# EasyEDA Pro project 无线充电接收端.epro, schematic 无线充电接收V2.0
Board Name: 无线充电接收V2.0; Create Date: 2025-05-22; Page Name: P1; Project Name: （5月更新）无线充电接收端; Schematic Name: 无线充电接收V2.0; Update Date: 2025-05-22; Company: 嘉立创EDA; Page Size: A4; Version: V1.0
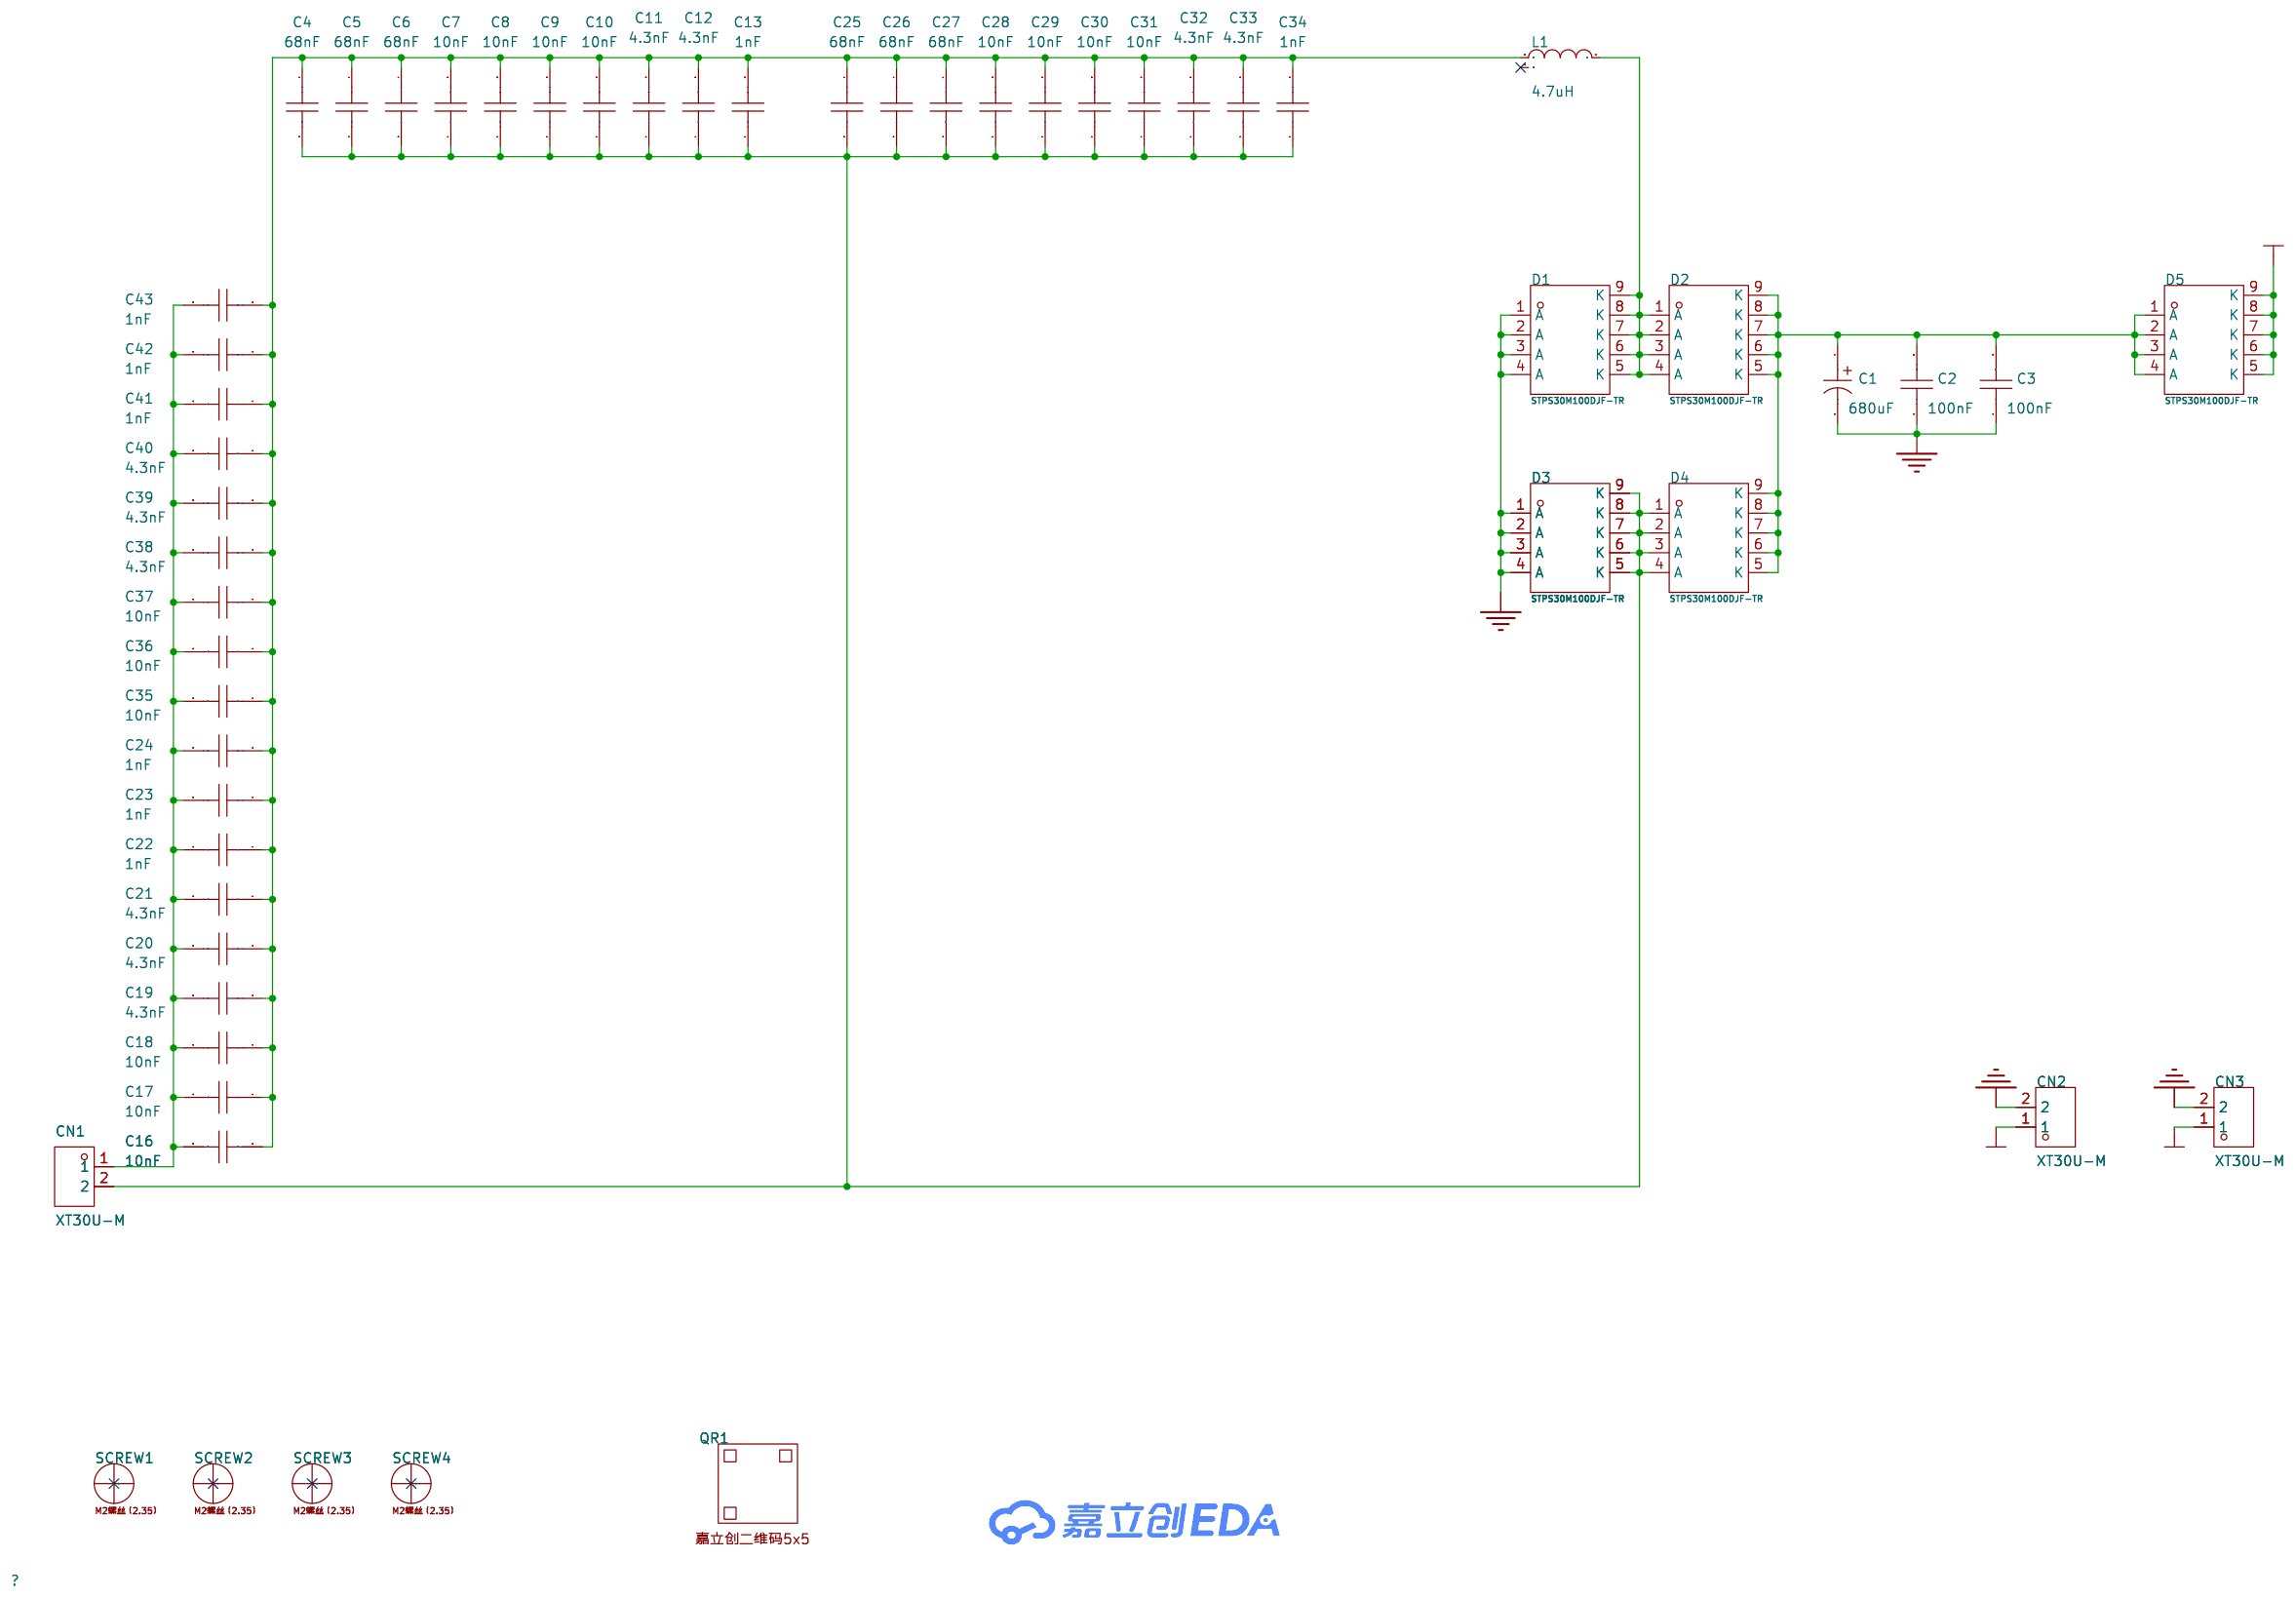
[diagram p2: schematic sheet]

## Parts
C1  680uF  [CAP-TH_BD8.0-P3.50-D0.6-FD]
C2  100nF  [C1206]
C3  100nF  [C1206]
C4  68nF  [C1206]
C5  68nF  [C1206]
C6  68nF  [C1206]
C7  10nF  [C1206]
C8  10nF  [C1206]
C9  10nF  [C1206]
C10  10nF  [C1206]
C11  4.3nF  [C1206]
C12  4.3nF  [C1206]
C13  1nF  [C1206]
C16  10nF  [C1206]
C17  10nF  [C1206]
C18  10nF  [C1206]
C19  4.3nF  [C1206]
C20  4.3nF  [C1206]
C21  4.3nF  [C1206]
C22  1nF  [C1206]
C23  1nF  [C1206]
C24  1nF  [C1206]
C25  68nF  [C1206]
C26  68nF  [C1206]
C27  68nF  [C1206]
C28  10nF  [C1206]
C29  10nF  [C1206]
C30  10nF  [C1206]
C31  10nF  [C1206]
C32  4.3nF  [C1206]
C33  4.3nF  [C1206]
C34  1nF  [C1206]
C35  10nF  [C1206]
C36  10nF  [C1206]
C37  10nF  [C1206]
C38  4.3nF  [C1206]
C39  4.3nF  [C1206]
C40  4.3nF  [C1206]
C41  1nF  [C1206]
C42  1nF  [C1206]
C43  1nF  [C1206]
CN1  XT30U-M  [CONN-TH_XT30U-M]
CN2  XT30U-M  [CONN-TH_XT30U-M]
CN3  XT30U-M  [CONN-TH_XT30U-M]
D1  STPS30M100DJF-TR  [PDFN-8_L5.8-W4.9-P1.27-LS6.1-BL]
D2  STPS30M100DJF-TR  [PDFN-8_L5.8-W4.9-P1.27-LS6.1-BL]
D3  STPS30M100DJF-TR  [PDFN-8_L5.8-W4.9-P1.27-LS6.1-BL]
D4  STPS30M100DJF-TR  [PDFN-8_L5.8-W4.9-P1.27-LS6.1-BL]
D5  STPS30M100DJF-TR  [PDFN-8_L5.8-W4.9-P1.27-LS6.1-BL]
L1  4.7uH  [IND-SMD_3P-L28.0-W19.0-LS27.0]
QR1  -  [JLC-QRCODE-5x5]
SCREW1  -  [M2螺丝（2.35）]
SCREW2  -  [M2螺丝（2.35）]
SCREW3  -  [M2螺丝（2.35）]
SCREW4  -  [M2螺丝（2.35）]

## Library data of the parts
C1 = 217EC0019: 容值:680uF;精度:±20%;额定电压:35V;纹波电流:3.65A@100kHz;等效串联电阻(ESR):28mΩ@100kHz;; LCSC Part Name: 680uF ±20% 35V; Supplier Part: C42371890; Manufacturer: KNSCHA(科尼盛); Supplier Footprint: 插件,D8xL16mm; Datasheet: https://atta.szlcsc.com/upload/public/pdf/source/20241106/965C52BEE72BE8020D9BF3C0AA67995E.pdf; Supplier: LCSC; Tolerance: ±20%; Voltage Rated: 35V; Ripple Current: 3.65A@100kHz; Equivalent Series Resistance(ESR): 28mΩ@100kHz; Lead Spacing: 3.5mm; Diameter: 8mm; Height - Seated (Max): 16mm; Lifetime @ Temp: 2000hrs@105℃; Operating Temperature: -55℃~+105℃
C2 C3 = GRM31C5C2A104JA01L: 容值:100nF;精度:±5%;额定电压:100V;材质(温度系数):C0G;; LCSC Part Name: 100nF ±5% 100V; Supplier Part: C405303; Manufacturer: muRata(村田); Supplier Footprint: 1206; Datasheet: https://atta.szlcsc.com/upload/public/pdf/source/20190717/C405303_DB26B790B590E67035A9C43E8E89903F.pdf; Supplier: LCSC; Tolerance: ±5%; Voltage Rated: 100V; Temperature Coefficient: C0G
C4-C6 C25-C27 = C3216C0G2A683JT000E: 容值:68nF;精度:±5%;额定电压:100V;温度系数:C0G;; LCSC Part Name: 68nF ±5% 100V; Supplier Part: C2991821; Manufacturer: TDK; Supplier Footprint: 1206; Datasheet: https://atta.szlcsc.com/upload/public/pdf/source/20220415/21C3EB6AB80DD056499B4D8EFDFCCE0A.pdf; Supplier: LCSC; Tolerance: ±5%; Voltage Rating: 100V; Temperature Coefficient: C0G
C7-C10 C16-C18 C28-C31 C35-C37 = GCM3195C2A103JA16D: 容值:10nF;精度:±5%;额定电压:100V;材质(温度系数):C0G;; LCSC Part Name: 10nF ±5% 100V; Supplier Part: C184799; Manufacturer: muRata(村田); Supplier Footprint: 1206; Datasheet: https://atta.szlcsc.com/upload/public/pdf/source/20191226/C475964_3FAF76C90CD8FFB09F50C7480ADA926F.pdf; Supplier: LCSC; Tolerance: ±5%; Voltage Rated: 100V; Temperature Coefficient: C0G
C11 C12 C19-C21 C32 C33 C38-C40 = GRM3195C2A432JA01D: 容值:4.3nF;精度:±5%;额定电压:100V;材质(温度系数):C0G;; LCSC Part Name: 4.3nF ±5% 100V; Supplier Part: C2178478; Manufacturer: muRata(村田); Supplier Footprint: 1206; Datasheet: https://atta.szlcsc.com/upload/public/pdf/source/20230811/FF87FF72FFBF946A2511FFE3CC64A1B1.pdf; Supplier: LCSC; Tolerance: ±5%; Voltage Rated: 100V; Temperature Coefficient: C0G
C13 C22-C24 C34 C41-C43 = CC1206JKNPOCBN102: 容值:1nF;精度:±5%;额定电压:1kV;材质(温度系数):NP0;; LCSC Part Name: 1nF ±5% 1kV; Supplier Part: C113872; Manufacturer: YAGEO(国巨); Supplier Footprint: 1206; Datasheet: https://atta.szlcsc.com/upload/public/pdf/source/20170914/C128857_1505359892143968080.pdf; Supplier: LCSC; Tolerance: ±5%; Voltage Rated: 1kV; Temperature Coefficient: NP0
CN1-CN3 = XT30U-M: 类别:-;类型1:-;; LCSC Part Name: AMASS(艾迈斯)轻量版锂电池插头公头 XT30U-M; Supplier Part: C99101; Manufacturer: AMASS(艾迈斯); JLCPCB Part Class: Extended Part; Datasheet: https://atta.szlcsc.com/upload/public/pdf/source/20170606/1496716542582.pdf; Supplier: LCSC; Brand: 艾迈斯; Type: 插头; Colour: 黄色; InterfaceType: 公头
D1-D5 = STPS30M100DJF-TR: 二极管配置:独立式;正向压降(Vf):960mV@30A;直流反向耐压(Vr):100V;整流电流:30A;; LCSC Part Name: 电压:100V 电流:30A; Supplier Part: C2688545; Manufacturer: ST(意法半导体); Supplier Footprint: Power-FLAT(5x6); Datasheet: https://atta.szlcsc.com/upload/public/pdf/source/20210617/C2688545_980EF861F75FD1B8BE8FC1FD966E2E4C.pdf; Supplier: LCSC; Diode Configuration: 独立式; Forward Voltage (Vf@If): 960mV@30A; Reverse Voltage (Vr): 100V; Rectified Current: 30A; Reverse Leakage Current (Ir): 100uA@100V
L1 = RSBPQ2918-4R7M: 电感值:4.7uH;精度:±20%;额定电流:47.5A;饱和电流(Isat):49.5A;类型:扁平线大电流电感;; LCSC Part Name: 扁线大电流电感; Supplier Part: C32712987; Manufacturer: Ruishen(瑞申电子); Supplier Footprint: SMD-3P,28x20.3mm; Datasheet: https://atta.szlcsc.com/upload/public/pdf/source/20240725/68006C9F1CA03DEDE5951C9F792F9D9D.pdf; Supplier: LCSC; Tolerance: ±20%; Rated Current: 47.5A; Current - Saturation (Isat): 49.5A; DC Resistance (DCR): 0.97mΩ; Type: 扁平线大电流电感
QR1 = 嘉立创二维码5x5: Check: false
SCREW1-SCREW4 = M2螺丝（2.35）

## Nets
GND: C1.2 C2.1 C3.1 CN2.2 CN3.2 D1.1(A) D1.2(A) D1.3(A) D1.4(A) D3.1(A) D3.2(A) D3.3(A) D3.4(A)
VCAP: CN2.1 CN3.1 D5.5(K) D5.6(K) D5.7(K) D5.8(K) D5.9(K)
$1N505: C4.2 C5.2 C6.2 C7.1 C8.1 C9.1 C10.1 C11.1 C12.1 C13.1 C25.2 C26.2 C27.2 C28.1 C29.1 C30.1 C31.1 C32.1 C33.1 C34.1 CN1.2 D3.5(K) D3.6(K) D3.7(K) D3.8(K) D3.9(K) D4.1(A) D4.2(A) D4.3(A) D4.4(A)
$1N630: D1.5(K) D1.6(K) D1.7(K) D1.8(K) D1.9(K) D2.1(A) D2.2(A) D2.3(A) D2.4(A) L1.1
$1N944: C1.1 C2.2 C3.2 D2.5(K) D2.6(K) D2.7(K) D2.8(K) D2.9(K) D4.5(K) D4.6(K) D4.7(K) D4.8(K) D4.9(K) D5.1(A) D5.2(A) D5.3(A) D5.4(A)
$1N10317: C4.1 C5.1 C6.1 C7.2 C8.2 C9.2 C10.2 C11.2 C12.2 C13.2 C16.1 C17.1 C18.1 C19.1 C20.1 C21.1 C22.1 C23.1 C24.1 C25.1 C26.1 C27.1 C28.2 C29.2 C30.2 C31.2 C32.2 C33.2 C34.2 C35.1 C36.1 C37.1 C38.1 C39.1 C40.1 C41.1 C42.1 C43.1 L1.2
$1N10703: C16.2 C17.2 C18.2 C19.2 C20.2 C21.2 C22.2 C23.2 C24.2 C35.2 C36.2 C37.2 C38.2 C39.2 C40.2 C41.2 C42.2 C43.2 CN1.1

Not connected (* = marked no-connect by the designer): L1 3*; SCREW1 1*; SCREW2 1*; SCREW3 1*; SCREW4 1*
